# Altium project 4006_Shield_Kart.PrjPcb
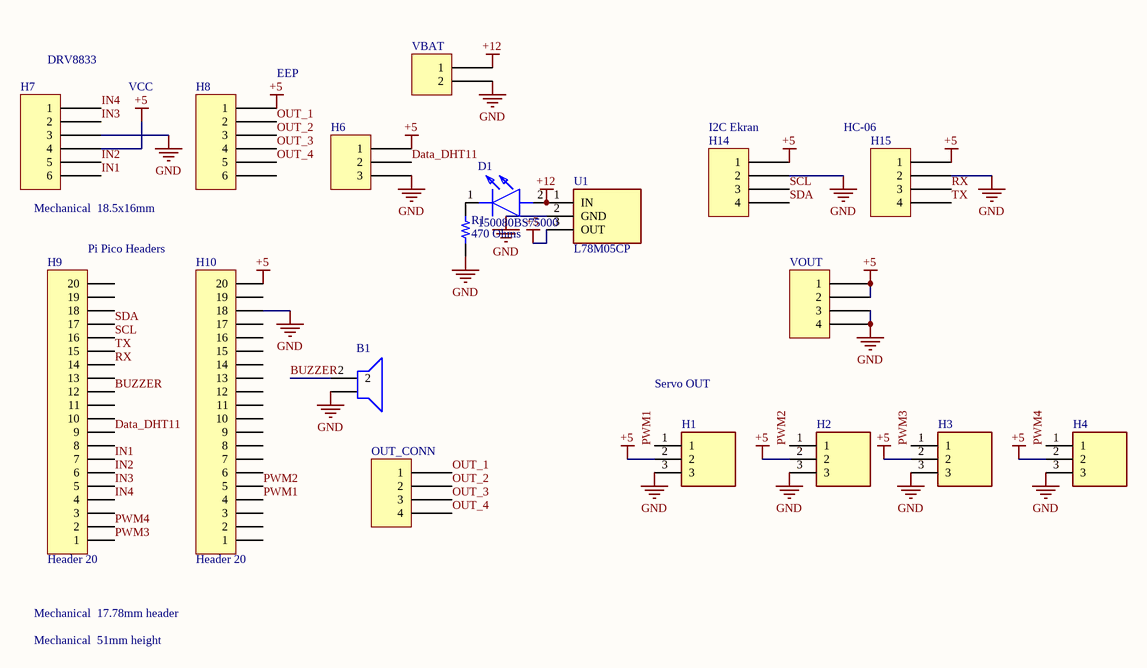
[diagram p0: 4006_Shield_Kart_Sematik.SchDoc]
1 sheet, 18 parts. Net scope: global (net labels, ports and power ports of the same name join across sheets).
Board file: 4006_Shield_Kart_PCB.PcbDoc

## Sheet 4006_Shield_Kart_Sematik.SchDoc
size C; SheetNumber: 1; SheetTotal: 1

### Parts
B1  SD1209T5-A1  [SD1209T5-A1]  (value not drawn)
D1  150080BS75000  [LEDC2012X80N]
H1  5-146278-3  [51462783]  (value not drawn)
H2  5-146278-3  [51462783]  (value not drawn)
H3  5-146278-3  [51462783]  (value not drawn)
H4  5-146278-3  [51462783]  (value not drawn)
H6  NPPN031BFCN-RC  [SULLINS NPPN031BFCN]  (value not drawn)
H7  NPPN061BFCN-RC  [SULLINS NPPN061BFCN]  (value not drawn)
H8  NPPN061BFCN-RC  [SULLINS NPPN061BFCN]  (value not drawn)
H9  Header 20  [HDR1X20]
H10  Header 20  [HDR1X20]
H14  M20-7820442  [HARWIN M20-7820445]  (value not drawn)
H15  M20-7820442  [HARWIN M20-7820445]  (value not drawn)
OUT_CONN  282834-4  [TE 282834-4]  (value not drawn)
R1  470 Ohms  [RES 0805_2012]
U1  L78M05CP  [TO255P460X1020X2030-3P]
VBAT  OQ0232510000G  [FCI 06-381-2PIN]  (value not drawn)
VOUT  OQ0432510000G  [FCI 06-381-4PIN]  (value not drawn)

### Nets
+5: H1.2 H2.2 H3.2 H4.2 H6.1 H7.4 H8.1 H10.20 H14.1 H15.1 U1.3(OUT) VOUT.1 VOUT.2
+12: D1.2(A) U1.1(IN) VBAT.1
GND: B1.?1 H1.3 H2.3 H3.3 H4.3 H6.3 H7.3 H10.18 H14.2 H15.2 R1.1 U1.2(GND) VBAT.2 VOUT.3 VOUT.4
BUZZER: B1.2 H9.12
Data_DHT11: H6.2 H9.9
IN1: H7.6 H9.7
IN2: H7.5 H9.6
IN3: H7.2 H9.5
IN4: H7.1 H9.4
OUT_1: H8.2 OUT_CONN.1
OUT_2: H8.3 OUT_CONN.2
OUT_3: H8.4 OUT_CONN.3
OUT_4: H8.5 OUT_CONN.4
PWM1: H1.1 H10.4
PWM2: H2.1 H10.5
PWM3: H3.1 H9.1
PWM4: H4.1 H9.2
RX: H9.14 H15.3
SCL: H9.16 H14.3
SDA: H9.17 H14.4
TX: H9.15 H15.4
NetD1_1: D1.1(K) R1.2

Not connected (* = marked no-connect by the designer): H8 6; H9 3 8 10 11 13 18 19 20; H10 1 2 3 6 7 8 9 10 11 12 13 14 15 16 17 19

### Notes on the sheet
- (near H7) DRV8833
- (near H8) EEP
- VCC
- (near H14) I2C Ekran
- (near H15) HC-06
- (near H7) Mechanical  18.5x16mm
- (near H9) Pi Pico Headers
- Servo OUT
- Mechanical  17.78mm header
- Mechanical  51mm height

### Library data of the parts
B1 = SD1209T5-A1: Loudspeaker or Buzzer; Manufacturer_Name: TDK; Datasheet Link: https://product.tdk.com/system/files/dam/doc/product/sw_piezo/sw_piezo/em-buzzer/catalog/electromagnetic_buzzer_sd_en.pdf; Manufacturer_Part_Number: SD1209T5-A1; Mouser Part Number: 810-SD1209T5-A1; Mouser Price/Stock: https://www.mouser.co.uk/ProductDetail/TDK/SD1209T5-A1?qs=6QK9sRmt5TllZYgulSSkFw%3D%3D; Arrow Part Number: SD1209T5-A1; Arrow Price/Stock: https://www.arrow.com/en/products/sd1209t5-a1/tdk?region=nac
D1 = 150080BS75000: LED; Manufacturer_Name: Wurth Elektronik; Datasheet Link: https://katalog.we-online.com/led/datasheet/150080BS75000.pdf; Height: 0.8mm; Manufacturer_Part_Number: 150080BS75000; Mouser Part Number: 710-150080BS75000; Mouser Price/Stock: https://www.mouser.co.uk/ProductDetail/Wurth-Elektronik/150080BS75000?qs=2kOmHSv6VfT2tBo3UPVqAQ%3D%3D
H1-H4 = 5-146278-3: Connector; Manufacturer_Name: TE Connectivity; Datasheet Link: https://www.mouser.com/datasheet/2/418/NG_CD_146278_H1-1238585.pdf; Height: 8.13mm; Manufacturer_Part_Number: 5-146278-3; Mouser Part Number: 571-5-146278-3; Mouser Price/Stock: https://www.mouser.co.uk/ProductDetail/TE-Connectivity/5-146278-3?qs=bwpFY26eRVfQGObR0Vkt1g%3D%3D; Arrow Part Number: 5-146278-3; Arrow Price/Stock: https://www.arrow.com/en/products/5-146278-3/te-connectivity?region=nac
H6 = NPPN031BFCN-RC: CONN HDR 3POS 0.079 GOLD PCB; Manufacturer: Sullins Connector Solutions; Connector Type: Header; Contact Length - Post: 0.094" (2.40mm); Current Rating (Amps): 2A; Material Flammability Rating: UL94 V-0; Number of Positions: 3; Number of Positions Loaded: All; Pitch - Mating: 0.079" (2.00mm); Style: Board to Board; Part Number: NPPN031BFCN-RC; ComponentLink1Description: Datasheet; ComponentLink1URL: https://drawings-pdf.s3.amazonaws.com/10483.pdf; ComponentLink2Description: DigiKey Link; ComponentLink2URL: https://www.digikey.com/en/products/detail/sullins-connector-solutions/NPPN031BFCN-RC/804805; Contact Finish - Mating: Gold; Contact Finish - Post: Gold; Contact Finish Thickness - Mating: Flash; Contact Type: Female Socket; Fastening Type: Push-Pull; Insulation Color: Black; Insulation Height: 0.173" (4.40mm); LastUpdated: 21.06.2022 14:42:20; Lifecycle Status: Active; Minimum Order: 1; Mounting Type: Through Hole; Number of Rows: 1; Operating Temperature: -40°C ~ 105°C; Packaging: Tube; Part Status: Active; Price: 0.25; Series: -; Supplier 1: DigiKey; Supplier Part Number 1: S5751-03-ND; Termination: Solder
H7 H8 = NPPN061BFCN-RC: CONN HDR 6POS 0.079 GOLD PCB; Manufacturer: Sullins Connector Solutions; Connector Type: Header; Contact Length - Post: 0.094" (2.40mm); Current Rating (Amps): 2A; Material Flammability Rating: UL94 V-0; Number of Positions: 6; Number of Positions Loaded: All; Pitch - Mating: 0.079" (2.00mm); Style: Board to Board; Part Number: NPPN061BFCN-RC; ComponentLink1Description: Datasheet; ComponentLink1URL: https://drawings-pdf.s3.amazonaws.com/10483.pdf; ComponentLink2Description: DigiKey Link; ComponentLink2URL: https://www.digikey.com/en/products/detail/sullins-connector-solutions/NPPN061BFCN-RC/804808; Contact Finish - Mating: Gold; Contact Finish - Post: Gold; Contact Finish Thickness - Mating: Flash; Contact Type: Female Socket; Fastening Type: Push-Pull; Insulation Color: Black; Insulation Height: 0.173" (4.40mm); LastUpdated: 21.06.2022 14:43:22; Lifecycle Status: Active; Minimum Order: 1; Mounting Type: Through Hole; Number of Rows: 1; Operating Temperature: -40°C ~ 105°C; Packaging: Tube; Part Status: Active; Price: 0.40; Series: -; Supplier 1: DigiKey; Supplier Part Number 1: S5751-06-ND; Termination: Solder
H9 H10 = Header 20: Header, 20-Pin; LatestRevisionDate: 17-Jul-2002; LatestRevisionNote: Re-released for DXP Platform.; Publisher: Altium Limited
H14 H15 = M20-7820442: CONN RCPT 4POS 0.1 GOLD PCB; Manufacturer: Harwin Inc.; Connector Type: Receptacle; Contact Length - Post: 0.118" (3.00mm); Current Rating (Amps): 3A; Mated Stacking Heights: 11.04mm, 12.63mm; Material Flammability Rating: UL94 V-0; Number of Positions: 4; Number of Positions Loaded: All; Pitch - Mating: 0.100" (2.54mm); Style: Board to Board or Cable; Part Number: M20-7820442; ComponentLink1Description: Datasheet; ComponentLink1URL: https://cdn.harwin.com/pdfs/Harwin_PC_Connectors_M20.pdf; ComponentLink2Description: DigiKey Link; ComponentLink2URL: https://www.digikey.com/en/products/detail/harwin-inc/M20-7820442/3727760; Contact Finish - Mating: Gold; Contact Finish - Post: Tin; Contact Finish Thickness - Mating: Flash; Contact Type: Female Socket; Fastening Type: Push-Pull; Insulation Color: Black; Insulation Height: 0.335" (8.51mm); LastUpdated: 21.09.2022 18:57:11; Lifecycle Status: Active; Minimum Order: 1; Mounting Type: Through Hole; Number of Rows: 1; Operating Temperature: -40°C ~ 105°C; Packaging: Tube; Part Status: Active; Price: 0.45; Series: M20; Supplier 1: DigiKey; Supplier Part Number 1: 952-1791-ND; Termination: Solder
OUT_CONN = 282834-4: TERM BLK 4P SIDE ENT 2.54MM PCB; Manufacturer: TE Connectivity AMP Connectors; Current: 10A; Mating Orientation: Horizontal with Board; Number of Levels: 1; Pitch: 0.100" (2.54mm); Positions Per Level: 4; Voltage: 150V; Wire Gauge: 16-30 AWG; Wire Termination: Screw - Rising Cage Clamp; Part Number: 282834-4; Color: Green; ComponentLink1Description: Datasheet; ComponentLink1URL: https://www.te.com/commerce/DocumentDelivery/DDEController?Action=srchrtrv&DocNm=282834&DocType=Customer+Drawing&DocLang=English; ComponentLink2Description: DigiKey Link; ComponentLink2URL: http://digikey.com/product-detail/en/te-connectivity-amp-connectors/282834-4/A98335-ND/1153265; LastUpdated: 15.01.2020 04:16:05; Lifecycle Status: Active; Minimum Order: 1; Mounting Type: Through Hole; Packaging: Bulk; Part Status: Active; Price: 2.68; Series: Buchanan; Supplier 1: DigiKey; Supplier Part Number 1: A98335-ND
R1 = CRGP0805F470R: RES 470 OHM 1% 1/3W 0805; Manufacturer: TE Connectivity Passive Product; Power (Watts): 0.333W, 1/3W; Temperature Coefficient: ±100ppm/°C; Part Number: CRGP0805F470R; Value: 470 Ohms; ComponentLink1Description: Datasheet; ComponentLink1URL: https://www.te.com/commerce/DocumentDelivery/DDEController?Action=srchrtrv&DocNm=9-1773463-9&DocType=DS&DocLang=English; ComponentLink2Description: DigiKey Link; ComponentLink2URL: https://www.digikey.com/en/products/detail/te-connectivity-passive-product/CRGP0805F470R/8577075; Composition: Thick Film; Device Package: 0805 (2012 Metric); Features: Pulse Withstanding; Height - Seated (Max): 0.026" (0.65mm); LastUpdated: 7.03.2023 20:41:48; Lifecycle Status: Active; Minimum Order: 1; Number of Terminations: 2; Operating Temperature: -55°C ~ 155°C; Package / Case: 0805 (2012 Metric); Packaging: TapeAndReel; PartId: 28801; Part Status: Active; Price: 0.03; Resistance: 470 Ohms; Series: CRGP; Size / Dimension: 0.079" L x 0.049" W (2.00mm x 1.25mm); Supplier 1: DigiKey; Supplier Part Number 1: A130473CT-ND; Supplier Device Package: 0805; Tolerance: ±1%
U1 = L78M05CP: Integrated Circuit; Manufacturer_Name: STMicroelectronics; Datasheet Link: http://www.st.com/web/en/resource/technical/document/datasheet/CD00000447.pdf; Height: 4.6mm; Manufacturer_Part_Number: L78M05CP; Mouser Part Number: 511-L78M05CP; Mouser Price/Stock: https://www.mouser.co.uk/ProductDetail/STMicroelectronics/L78M05CP?qs=W%252B4obUA0F3anQylSbAkrfw%3D%3D; Arrow Part Number: L78M05CP; Arrow Price/Stock: https://www.arrow.com/en/products/l78m05cp/stmicroelectronics?region=europe
VBAT = OQ0232510000G: TERM BLOCK HDR 2POS 90DEG 3.81MM; Manufacturer: Amphenol Anytek; Current - UL: 10A; Header Orientation: 90°, Right Angle; Number of Levels: 1; Number of Positions: 2; Pitch: 0.150" (3.81mm); Voltage - UL: 300V; Part Number: OQ0232510000G; Color: Green; ComponentLink1Description: Datasheet; ComponentLink1URL: http://portal.fciconnect.com/Comergent//fci/drawing/oqxx32x100j0g.pdf; ComponentLink2Description: DigiKey Link; ComponentLink2URL: //digikey.com/product-detail/en/amphenol-anytek/OQ0232510000G/609-3819-ND/2261255; Contact Mating Finish: Tin; LastUpdated: 16.12.2019 19:14:30; Lifecycle Status: 0; Minimum Order: 1; Mounting Type: Through Hole; Operating Temperature: -40°C ~ 115°C; Packaging: Bulk; Part Status: Active; Positions Per Level: 2; Price: 0.49; Series: 06-381; Supplier 1: DigiKey; Supplier Part Number 1: 609-3819-ND; Termination Style: Solder; Type: Header, Male Pins, Shrouded (4 Side)
VOUT = OQ0432510000G: TERM BLOCK HDR 4POS 90DEG 3.81MM; Manufacturer: Amphenol Anytek; Current - UL: 10A; Header Orientation: 90°, Right Angle; Number of Levels: 1; Number of Positions: 4; Pitch: 0.150" (3.81mm); Voltage - UL: 300V; Part Number: OQ0432510000G; Color: Green; ComponentLink1Description: Datasheet; ComponentLink1URL: http://portal.fciconnect.com/Comergent//fci/drawing/oqxx32x100j0g.pdf; ComponentLink2Description: DigiKey Link; ComponentLink2URL: //digikey.com/product-detail/en/amphenol-anytek/OQ0432510000G/609-3821-ND/2261267; Contact Mating Finish: Tin; LastUpdated: 16.12.2019 19:15:03; Lifecycle Status: 0; Minimum Order: 1; Mounting Type: Through Hole; Operating Temperature: -40°C ~ 115°C; Packaging: Bulk; Part Status: Active; Positions Per Level: 4; Price: 0.71; Series: 06-381; Supplier 1: DigiKey; Supplier Part Number 1: 609-3821-ND; Termination Style: Solder; Type: Header, Male Pins, Shrouded (4 Side)